# EAGLE schematic El-Plan (EAGLE 9.6.1)
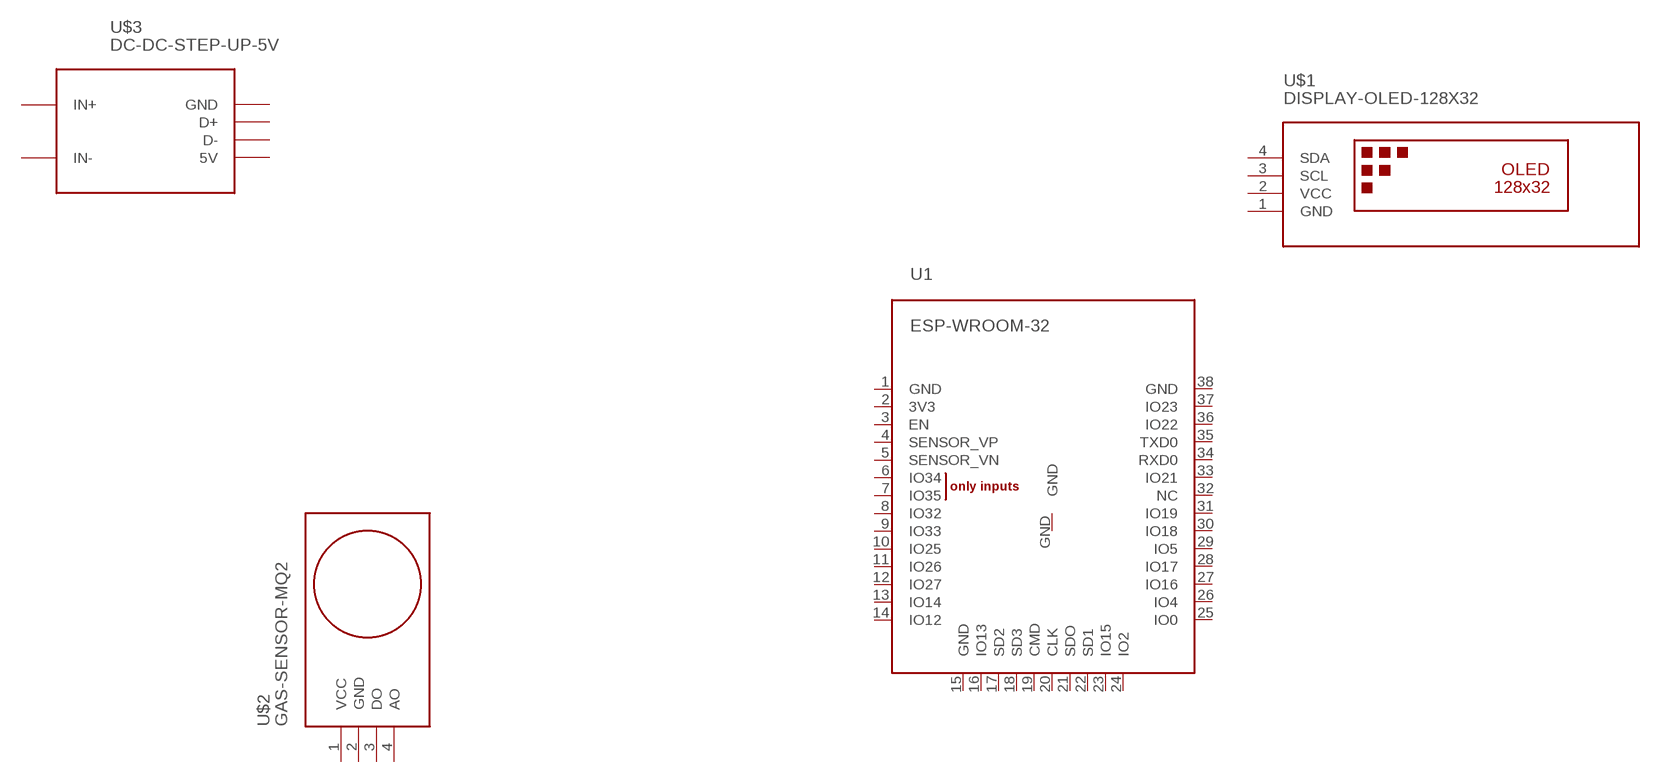
[diagram p0: schematic, sheet 1]

## Parts
U1  ESP-WROOM-32  [ESP-WROOM-32]
U$1  DISPLAY-OLED-128X32  [DISPLAY-OLED-128X32]
U$2  GAS-SENSOR-MQ2  [GAS-SENSOR-MQ2]
U$3  DC-DC-STEP-UP-5V  [DC-DC-STEP-UP-5V]
Unconnected: U1.1(GND) U1.2(3V3) U1.3(EN) U1.4(SENSOR_VP) U1.5(SENSOR_VN) U1.6(IO34) U1.7(IO35) U1.8(IO32) U1.9(IO33) U1.10(IO25) U1.11(IO26) U1.12(IO27) U1.13(IO14) U1.14(IO12) U1.15(GND) U1.16(IO13) U1.17(SD2) U1.18(SD3) U1.19(CMD) U1.20(CLK) U1.21(SDO) U1.22(SD1) U1.23(IO15) U1.24(IO2) U1.25(IO0) U1.26(IO4) U1.27(IO16) U1.28(IO17) U1.29(IO5) U1.30(IO18) U1.31(IO19) U1.32(NC) U1.33(IO21) U1.34(RXD0) U1.35(TXD0) U1.36(IO22) U1.37(IO23) U1.38(GND) U1.GND U$1.3(SCL) U$1.4(SDA) U$2.3(DO) U$2.4(AO) U$3.5V U$3.D+ U$3.D- U$3.GND

## Power pins joined to a net without a drawn wire
GND: U$1.1(GND) U$2.2(GND)
IN+: U$3.IN+
IN-: U$3.IN-
VCC: U$1.2(VCC) U$2.1(VCC)

## Library data of the parts
U1 = esp32:ESP-WROOM-32
U$1 = diy-modules:DISPLAY-OLED-128X32: 128x32 Dot Matrix OLED Module with I2C interface based on SSD1306 chip More details available here: http://www.tinyosshop.com/index.php?route=product/product&product_id=953 Schematic available here: http://www.tinyosshop.com/datasheet/OLED%2012832.pdf SSD1306 datasheet: https://cdn-shop.adafruit.com/datasheets/SSD1306.pdf Click here to find device on ebay.com <http://www.ebay.com/sch/oled+display+128x32+i2c>
U$2 = diy-modules:GAS-SENSOR-MQ2: Gas Sensor based on MQ-2 device Guide describing how to use MQ-2 sensor with Arduino is available here: http://www.instructables.com/id/How-to-use-MQ2-Gas-Sensor-Arduino-Tutorial/ MQ-2 sensor datasheet is available here: http://gas-sensor.ru/pdf/combustible-gas-sensor.pdf Click here to find device on ebay.com <http://www.ebay.com/sch/mq2+sensor+module+smoke>
U$3 = diy-modules:DC-DC-STEP-UP-5V: DC/DC Step-Up Converter